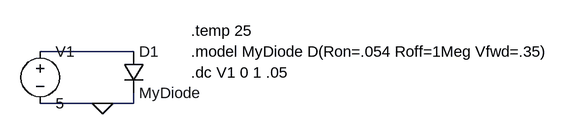
[diagram p0: schematic Q3_1_4.asc]
Q3_1_4.asc, the LTspice schematic file:
Version 4.1
SHEET 1 900 680
WIRE 208 128 64 128
WIRE 160 208 64 208
WIRE 208 208 208 192
WIRE 208 208 160 208
FLAG 160 208 0
SYMBOL diode 192 128 R0
SYMATTR InstName D1
SYMATTR Value MyDiode
SYMBOL voltage 64 112 R0
WINDOW 123 0 0 Left 0
WINDOW 39 0 0 Left 0
SYMATTR InstName V1
SYMATTR Value 5
TEXT 296 96 Left 2 !.temp 25
TEXT 296 128 Left 2 !.model MyDiode D(Ron=.054 Roff=1Meg Vfwd=.35)
TEXT 296 160 Left 2 !.dc V1 0 1 .05

The netlist it stands for:
* Q3_1_4.asc
D1 N001 0 MyDiode
V1 N001 0 5
.model D D
.lib standard.dio
.temp 25
.model MyDiode D(Ron=.054 Roff=1Meg Vfwd=.35)
.dc V1 0 1 .05
.backanno
.end